# EAGLE design Rev01 (EAGLE 7.4.0)
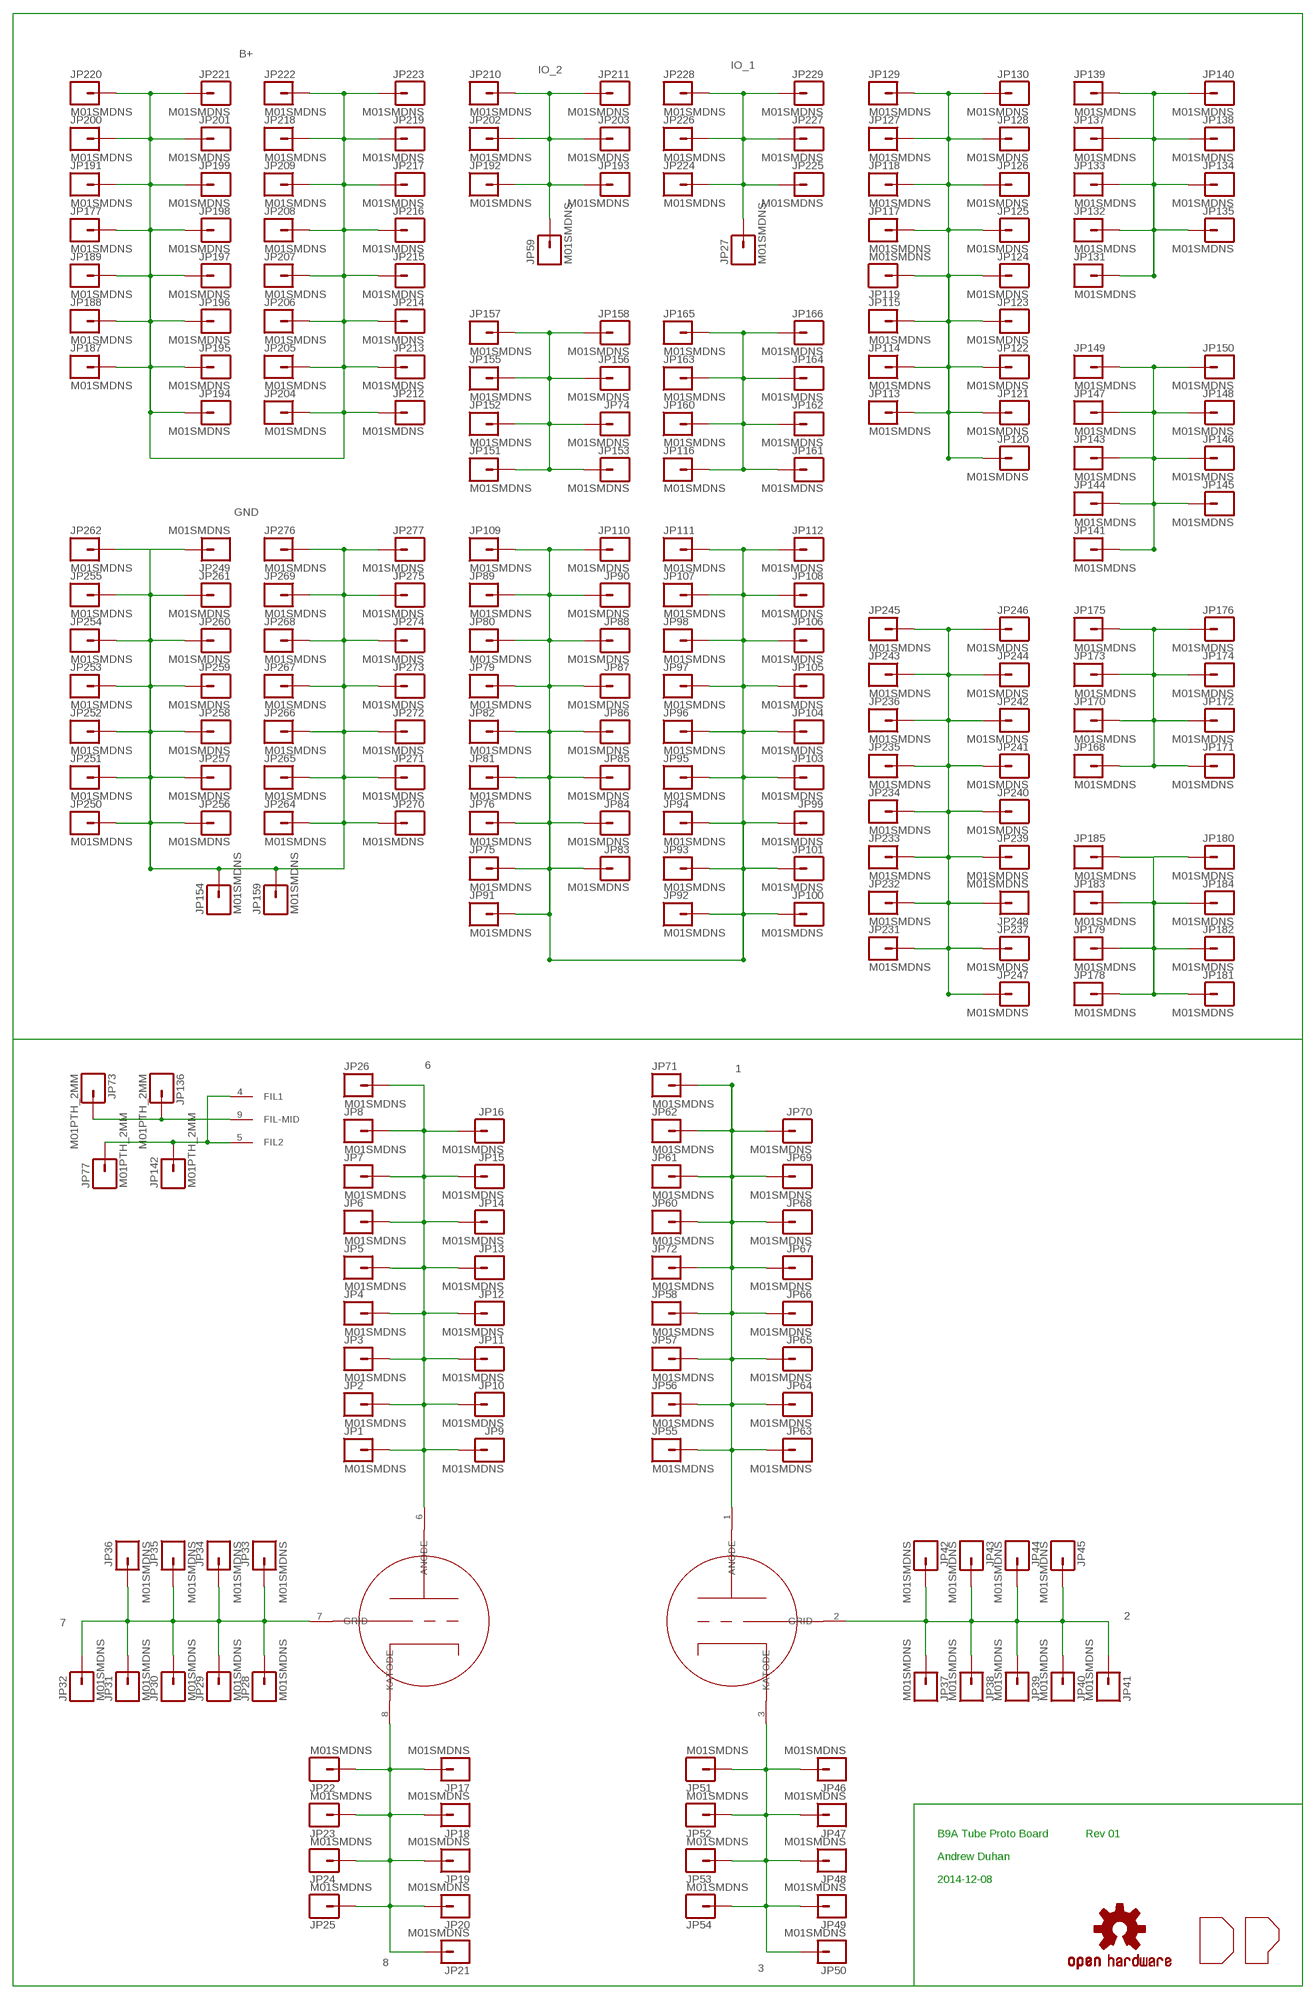
[diagram p0: schematic, sheet 1]

## Parts
JP1  M01SMDNS  [1X01NS]
JP2  M01SMDNS  [1X01NS]
JP3  M01SMDNS  [1X01NS]
JP4  M01SMDNS  [1X01NS]
JP5  M01SMDNS  [1X01NS]
JP6  M01SMDNS  [1X01NS]
JP7  M01SMDNS  [1X01NS]
JP8  M01SMDNS  [1X01NS]
JP9  M01SMDNS  [1X01NS]
JP10  M01SMDNS  [1X01NS]
JP11  M01SMDNS  [1X01NS]
JP12  M01SMDNS  [1X01NS]
JP13  M01SMDNS  [1X01NS]
JP14  M01SMDNS  [1X01NS]
JP15  M01SMDNS  [1X01NS]
JP16  M01SMDNS  [1X01NS]
JP17  M01SMDNS  [1X01NS]
JP18  M01SMDNS  [1X01NS]
JP19  M01SMDNS  [1X01NS]
JP20  M01SMDNS  [1X01NS]
JP21  M01SMDNS  [1X01NS]
JP22  M01SMDNS  [1X01NS]
JP23  M01SMDNS  [1X01NS]
JP24  M01SMDNS  [1X01NS]
JP25  M01SMDNS  [1X01NS]
JP26  M01SMDNS  [1X01NS]
JP27  M01SMDNS  [1X01NS]
JP28  M01SMDNS  [1X01NS]
JP29  M01SMDNS  [1X01NS]
JP30  M01SMDNS  [1X01NS]
JP31  M01SMDNS  [1X01NS]
JP32  M01SMDNS  [1X01NS]
JP33  M01SMDNS  [1X01NS]
JP34  M01SMDNS  [1X01NS]
JP35  M01SMDNS  [1X01NS]
JP36  M01SMDNS  [1X01NS]
JP37  M01SMDNS  [1X01NS]
JP38  M01SMDNS  [1X01NS]
JP39  M01SMDNS  [1X01NS]
JP40  M01SMDNS  [1X01NS]
JP41  M01SMDNS  [1X01NS]
JP42  M01SMDNS  [1X01NS]
JP43  M01SMDNS  [1X01NS]
JP44  M01SMDNS  [1X01NS]
JP45  M01SMDNS  [1X01NS]
JP46  M01SMDNS  [1X01NS]
JP47  M01SMDNS  [1X01NS]
JP48  M01SMDNS  [1X01NS]
JP49  M01SMDNS  [1X01NS]
JP50  M01SMDNS  [1X01NS]
JP51  M01SMDNS  [1X01NS]
JP52  M01SMDNS  [1X01NS]
JP53  M01SMDNS  [1X01NS]
JP54  M01SMDNS  [1X01NS]
JP55  M01SMDNS  [1X01NS]
JP56  M01SMDNS  [1X01NS]
JP57  M01SMDNS  [1X01NS]
JP58  M01SMDNS  [1X01NS]
JP59  M01SMDNS  [1X01NS]
JP60  M01SMDNS  [1X01NS]
JP61  M01SMDNS  [1X01NS]
JP62  M01SMDNS  [1X01NS]
JP63  M01SMDNS  [1X01NS]
JP64  M01SMDNS  [1X01NS]
JP65  M01SMDNS  [1X01NS]
JP66  M01SMDNS  [1X01NS]
JP67  M01SMDNS  [1X01NS]
JP68  M01SMDNS  [1X01NS]
JP69  M01SMDNS  [1X01NS]
JP70  M01SMDNS  [1X01NS]
JP71  M01SMDNS  [1X01NS]
JP72  M01SMDNS  [1X01NS]
JP73  M01PTH_2MM  [1X01_2MM]
JP74  M01SMDNS  [1X01NS]
JP75  M01SMDNS  [1X01NS]
JP76  M01SMDNS  [1X01NS]
JP77  M01PTH_2MM  [1X01_2MM]
JP79  M01SMDNS  [1X01NS]
JP80  M01SMDNS  [1X01NS]
JP81  M01SMDNS  [1X01NS]
JP82  M01SMDNS  [1X01NS]
JP83  M01SMDNS  [1X01NS]
JP84  M01SMDNS  [1X01NS]
JP85  M01SMDNS  [1X01NS]
JP86  M01SMDNS  [1X01NS]
JP87  M01SMDNS  [1X01NS]
JP88  M01SMDNS  [1X01NS]
JP89  M01SMDNS  [1X01NS]
JP90  M01SMDNS  [1X01NS]
JP91  M01SMDNS  [1X01NS]
JP92  M01SMDNS  [1X01NS]
JP93  M01SMDNS  [1X01NS]
JP94  M01SMDNS  [1X01NS]
JP95  M01SMDNS  [1X01NS]
JP96  M01SMDNS  [1X01NS]
JP97  M01SMDNS  [1X01NS]
JP98  M01SMDNS  [1X01NS]
JP99  M01SMDNS  [1X01NS]
JP100  M01SMDNS  [1X01NS]
JP101  M01SMDNS  [1X01NS]
JP103  M01SMDNS  [1X01NS]
JP104  M01SMDNS  [1X01NS]
JP105  M01SMDNS  [1X01NS]
JP106  M01SMDNS  [1X01NS]
JP107  M01SMDNS  [1X01NS]
JP108  M01SMDNS  [1X01NS]
JP109  M01SMDNS  [1X01NS]
JP110  M01SMDNS  [1X01NS]
JP111  M01SMDNS  [1X01NS]
JP112  M01SMDNS  [1X01NS]
JP113  M01SMDNS  [1X01NS]
JP114  M01SMDNS  [1X01NS]
JP115  M01SMDNS  [1X01NS]
JP116  M01SMDNS  [1X01NS]
JP117  M01SMDNS  [1X01NS]
JP118  M01SMDNS  [1X01NS]
JP119  M01SMDNS  [1X01NS]
JP120  M01SMDNS  [1X01NS]
JP121  M01SMDNS  [1X01NS]
JP122  M01SMDNS  [1X01NS]
JP123  M01SMDNS  [1X01NS]
JP124  M01SMDNS  [1X01NS]
JP125  M01SMDNS  [1X01NS]
JP126  M01SMDNS  [1X01NS]
JP127  M01SMDNS  [1X01NS]
JP128  M01SMDNS  [1X01NS]
JP129  M01SMDNS  [1X01NS]
JP130  M01SMDNS  [1X01NS]
JP131  M01SMDNS  [1X01NS]
JP132  M01SMDNS  [1X01NS]
JP133  M01SMDNS  [1X01NS]
JP134  M01SMDNS  [1X01NS]
JP135  M01SMDNS  [1X01NS]
JP136  M01PTH_2MM  [1X01_2MM]
JP137  M01SMDNS  [1X01NS]
JP138  M01SMDNS  [1X01NS]
JP139  M01SMDNS  [1X01NS]
JP140  M01SMDNS  [1X01NS]
JP141  M01SMDNS  [1X01NS]
JP142  M01PTH_2MM  [1X01_2MM]
JP143  M01SMDNS  [1X01NS]
JP144  M01SMDNS  [1X01NS]
JP145  M01SMDNS  [1X01NS]
JP146  M01SMDNS  [1X01NS]
JP147  M01SMDNS  [1X01NS]
JP148  M01SMDNS  [1X01NS]
JP149  M01SMDNS  [1X01NS]
JP150  M01SMDNS  [1X01NS]
JP151  M01SMDNS  [1X01NS]
JP152  M01SMDNS  [1X01NS]
JP153  M01SMDNS  [1X01NS]
JP154  M01SMDNS  [1X01NS]
JP155  M01SMDNS  [1X01NS]
JP156  M01SMDNS  [1X01NS]
JP157  M01SMDNS  [1X01NS]
JP158  M01SMDNS  [1X01NS]
JP159  M01SMDNS  [1X01NS]
JP160  M01SMDNS  [1X01NS]
JP161  M01SMDNS  [1X01NS]
JP162  M01SMDNS  [1X01NS]
JP163  M01SMDNS  [1X01NS]
JP164  M01SMDNS  [1X01NS]
JP165  M01SMDNS  [1X01NS]
JP166  M01SMDNS  [1X01NS]
JP168  M01SMDNS  [1X01NS]
JP170  M01SMDNS  [1X01NS]
JP171  M01SMDNS  [1X01NS]
JP172  M01SMDNS  [1X01NS]
JP173  M01SMDNS  [1X01NS]
JP174  M01SMDNS  [1X01NS]
JP175  M01SMDNS  [1X01NS]
JP176  M01SMDNS  [1X01NS]
JP177  M01SMDNS  [1X01NS]
JP178  M01SMDNS  [1X01NS]
JP179  M01SMDNS  [1X01NS]
JP180  M01SMDNS  [1X01NS]
JP181  M01SMDNS  [1X01NS]
JP182  M01SMDNS  [1X01NS]
JP183  M01SMDNS  [1X01NS]
JP184  M01SMDNS  [1X01NS]
JP185  M01SMDNS  [1X01NS]
JP187  M01SMDNS  [1X01NS]
JP188  M01SMDNS  [1X01NS]
JP189  M01SMDNS  [1X01NS]
JP191  M01SMDNS  [1X01NS]
JP192  M01SMDNS  [1X01NS]
JP193  M01SMDNS  [1X01NS]
JP194  M01SMDNS  [1X01NS]
JP195  M01SMDNS  [1X01NS]
JP196  M01SMDNS  [1X01NS]
JP197  M01SMDNS  [1X01NS]
JP198  M01SMDNS  [1X01NS]
JP199  M01SMDNS  [1X01NS]
JP200  M01SMDNS  [1X01NS]
JP201  M01SMDNS  [1X01NS]
JP202  M01SMDNS  [1X01NS]
JP203  M01SMDNS  [1X01NS]
JP204  M01SMDNS  [1X01NS]
JP205  M01SMDNS  [1X01NS]
JP206  M01SMDNS  [1X01NS]
JP207  M01SMDNS  [1X01NS]
JP208  M01SMDNS  [1X01NS]
JP209  M01SMDNS  [1X01NS]
JP210  M01SMDNS  [1X01NS]
JP211  M01SMDNS  [1X01NS]
JP212  M01SMDNS  [1X01NS]
JP213  M01SMDNS  [1X01NS]
JP214  M01SMDNS  [1X01NS]
JP215  M01SMDNS  [1X01NS]
JP216  M01SMDNS  [1X01NS]
JP217  M01SMDNS  [1X01NS]
JP218  M01SMDNS  [1X01NS]
JP219  M01SMDNS  [1X01NS]
JP220  M01SMDNS  [1X01NS]
JP221  M01SMDNS  [1X01NS]
JP222  M01SMDNS  [1X01NS]
JP223  M01SMDNS  [1X01NS]
JP224  M01SMDNS  [1X01NS]
JP225  M01SMDNS  [1X01NS]
JP226  M01SMDNS  [1X01NS]
JP227  M01SMDNS  [1X01NS]
JP228  M01SMDNS  [1X01NS]
JP229  M01SMDNS  [1X01NS]
JP231  M01SMDNS  [1X01NS]
JP232  M01SMDNS  [1X01NS]
JP233  M01SMDNS  [1X01NS]
JP234  M01SMDNS  [1X01NS]
JP235  M01SMDNS  [1X01NS]
JP236  M01SMDNS  [1X01NS]
JP237  M01SMDNS  [1X01NS]
JP239  M01SMDNS  [1X01NS]
JP240  M01SMDNS  [1X01NS]
JP241  M01SMDNS  [1X01NS]
JP242  M01SMDNS  [1X01NS]
JP243  M01SMDNS  [1X01NS]
JP244  M01SMDNS  [1X01NS]
JP245  M01SMDNS  [1X01NS]
JP246  M01SMDNS  [1X01NS]
JP247  M01SMDNS  [1X01NS]
JP248  M01SMDNS  [1X01NS]
JP249  M01SMDNS  [1X01NS]
JP250  M01SMDNS  [1X01NS]
JP251  M01SMDNS  [1X01NS]
JP252  M01SMDNS  [1X01NS]
JP253  M01SMDNS  [1X01NS]
JP254  M01SMDNS  [1X01NS]
JP255  M01SMDNS  [1X01NS]
JP256  M01SMDNS  [1X01NS]
JP257  M01SMDNS  [1X01NS]
JP258  M01SMDNS  [1X01NS]
JP259  M01SMDNS  [1X01NS]
JP260  M01SMDNS  [1X01NS]
JP261  M01SMDNS  [1X01NS]
JP262  M01SMDNS  [1X01NS]
JP264  M01SMDNS  [1X01NS]
JP265  M01SMDNS  [1X01NS]
JP266  M01SMDNS  [1X01NS]
JP267  M01SMDNS  [1X01NS]
JP268  M01SMDNS  [1X01NS]
JP269  M01SMDNS  [1X01NS]
JP270  M01SMDNS  [1X01NS]
JP271  M01SMDNS  [1X01NS]
JP272  M01SMDNS  [1X01NS]
JP273  M01SMDNS  [1X01NS]
JP274  M01SMDNS  [1X01NS]
JP275  M01SMDNS  [1X01NS]
JP276  M01SMDNS  [1X01NS]
JP277  M01SMDNS  [1X01NS]
LOGO1  OSHW-LOGOM  [OSHW-LOGO-M]
U$1  12AX7  [12AX7-ROUND]
U$2  DP_LOGO  [DP_LOGO]

## Nets
1: JP55.1 JP56.1 JP57.1 JP58.1 JP60.1 JP61.1 JP62.1 JP63.1 JP64.1 JP65.1 JP66.1 JP67.1 JP68.1 JP69.1 JP70.1 JP71.1 JP72.1 U$1.1(ANODE)
2: JP37.1 JP38.1 JP39.1 JP40.1 JP41.1 JP42.1 JP43.1 JP44.1 JP45.1 U$1.2(GRID)
3: JP46.1 JP47.1 JP48.1 JP49.1 JP50.1 JP51.1 JP52.1 JP53.1 JP54.1 U$1.3(KATODE)
4/5: JP77.1 JP142.1 U$1.4(FIL1) U$1.5(FIL2)
6: JP1.1 JP2.1 JP3.1 JP4.1 JP5.1 JP6.1 JP7.1 JP8.1 JP9.1 JP10.1 JP11.1 JP12.1 JP13.1 JP14.1 JP15.1 JP16.1 JP26.1 U$1.6(ANODE)
7: JP28.1 JP29.1 JP30.1 JP31.1 JP32.1 JP33.1 JP34.1 JP35.1 JP36.1 U$1.7(GRID)
8: JP17.1 JP18.1 JP19.1 JP20.1 JP21.1 JP22.1 JP23.1 JP24.1 JP25.1 U$1.8(KATODE)
9: JP73.1 JP136.1 U$1.9(FIL-MID)
B+: JP177.1 JP187.1 JP188.1 JP189.1 JP191.1 JP194.1 JP195.1 JP196.1 JP197.1 JP198.1 JP199.1 JP200.1 JP201.1 JP204.1 JP205.1 JP206.1 JP207.1 JP208.1 JP209.1 JP212.1 JP213.1 JP214.1 JP215.1 JP216.1 JP217.1 JP218.1 JP219.1 JP220.1 JP221.1 JP222.1 JP223.1
GND: JP154.1 JP159.1 JP249.1 JP250.1 JP251.1 JP252.1 JP253.1 JP254.1 JP255.1 JP256.1 JP257.1 JP258.1 JP259.1 JP260.1 JP261.1 JP262.1 JP264.1 JP265.1 JP266.1 JP267.1 JP268.1 JP269.1 JP270.1 JP271.1 JP272.1 JP273.1 JP274.1 JP275.1 JP276.1 JP277.1
IO_1: JP27.1 JP224.1 JP225.1 JP226.1 JP227.1 JP228.1 JP229.1
IO_2: JP59.1 JP192.1 JP193.1 JP202.1 JP203.1 JP210.1 JP211.1
N$7: JP75.1 JP76.1 JP79.1 JP80.1 JP81.1 JP82.1 JP83.1 JP84.1 JP85.1 JP86.1 JP87.1 JP88.1 JP89.1 JP90.1 JP91.1 JP92.1 JP93.1 JP94.1 JP95.1 JP96.1 JP97.1 JP98.1 JP99.1 JP100.1 JP101.1 JP103.1 JP104.1 JP105.1 JP106.1 JP107.1 JP108.1 JP109.1 JP110.1 JP111.1 JP112.1
N$8: JP113.1 JP114.1 JP115.1 JP117.1 JP118.1 JP119.1 JP120.1 JP121.1 JP122.1 JP123.1 JP124.1 JP125.1 JP126.1 JP127.1 JP128.1 JP129.1 JP130.1
N$9: JP131.1 JP132.1 JP133.1 JP134.1 JP135.1 JP137.1 JP138.1 JP139.1 JP140.1
N$10: JP141.1 JP143.1 JP144.1 JP145.1 JP146.1 JP147.1 JP148.1 JP149.1 JP150.1
N$11: JP74.1 JP151.1 JP152.1 JP153.1 JP155.1 JP156.1 JP157.1 JP158.1
N$12: JP116.1 JP160.1 JP161.1 JP162.1 JP163.1 JP164.1 JP165.1 JP166.1
N$13: JP168.1 JP170.1 JP171.1 JP172.1 JP173.1 JP174.1 JP175.1 JP176.1
N$14: JP178.1 JP179.1 JP180.1 JP181.1 JP182.1 JP183.1 JP184.1 JP185.1
N$18: JP231.1 JP232.1 JP233.1 JP234.1 JP235.1 JP236.1 JP237.1 JP239.1 JP240.1 JP241.1 JP242.1 JP243.1 JP244.1 JP245.1 JP246.1 JP247.1 JP248.1

## Notes on the sheet
- B9A Tube Proto Board | Rev 01
- Andrew Duhan
- 2014-12-08

## Library data of the parts
JP1-JP77 JP79-JP101 JP103-JP166 JP168 JP170-JP185 JP187-JP189 JP191-JP229 JP231-JP237 JP239-JP262 JP264-JP277 = SparkFun-Connectors:M01: Header 1 Standard 1-pin 0.1" header. Use with straight break away headers (SKU : PRT-00116), right angle break away headers (PRT-00553), swiss pins (PRT-00743), machine pins (PRT-00117), and female headers (PRT-00115).
LOGO1 = SparkFun-Aesthetics:OSHW-LOGO: Open Source Hardware Logo This logo indicates the piece of hardware it is found on incorporates a OSHW license and/or adheres to the definition of open source hardware found here: http://freedomdefined.org/OSHW
U$1 = 12ax7:12AX7
U$2 = myparts:DP_LOGO: Duhan Power! logo

## Board
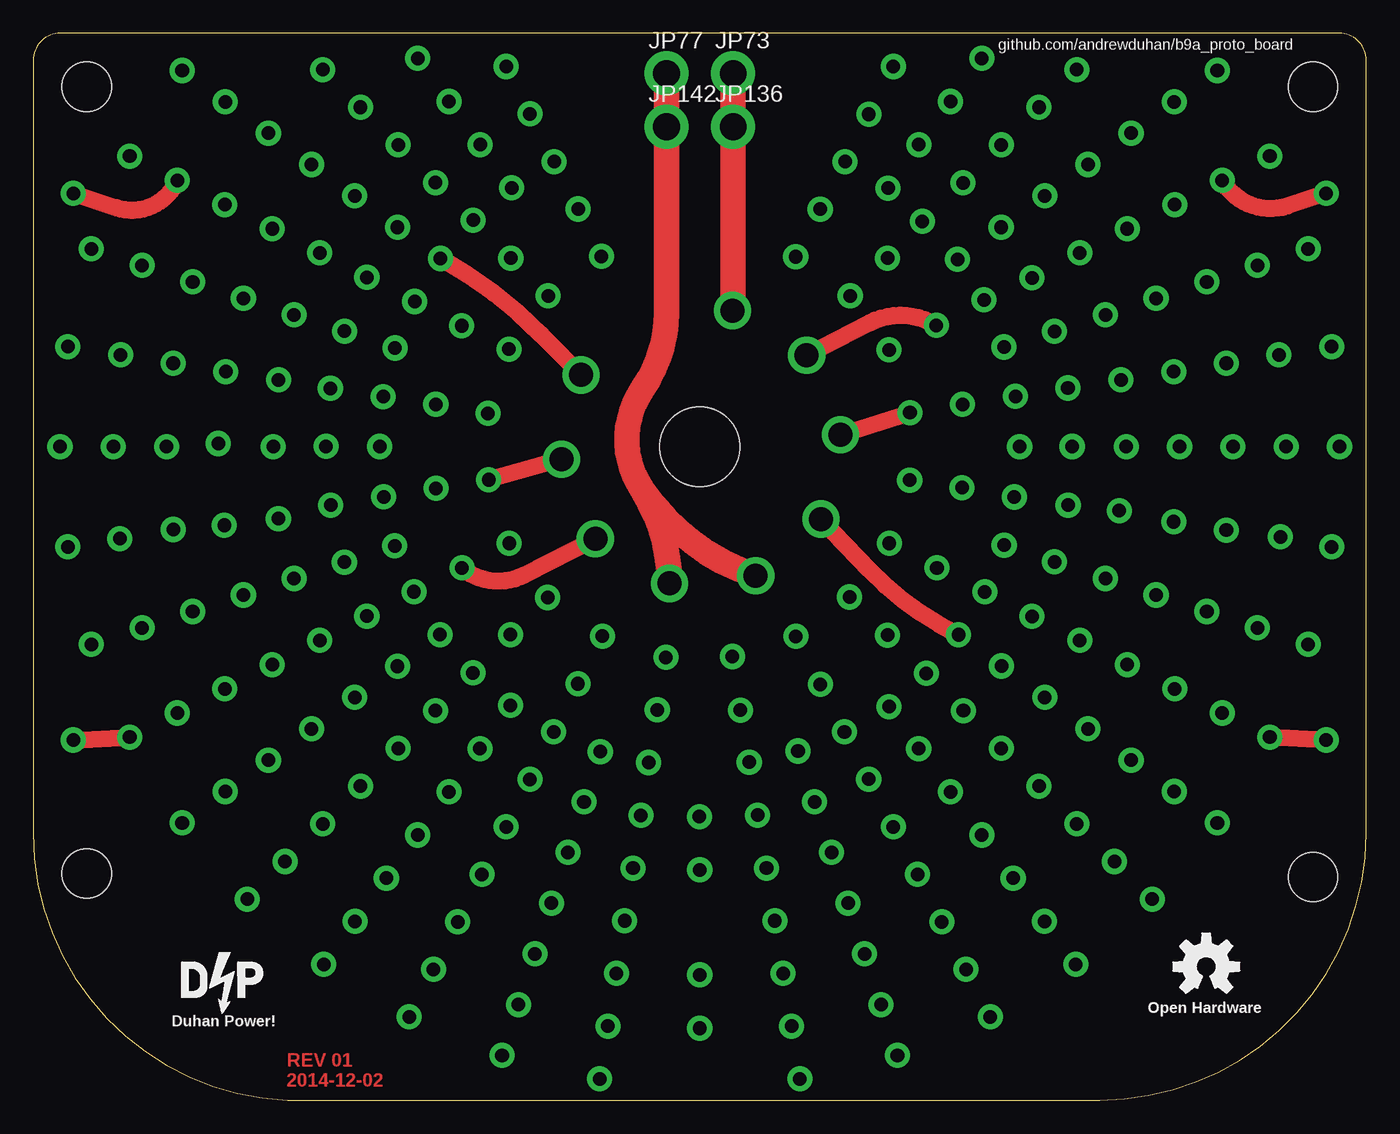
[diagram p1: board, top side]
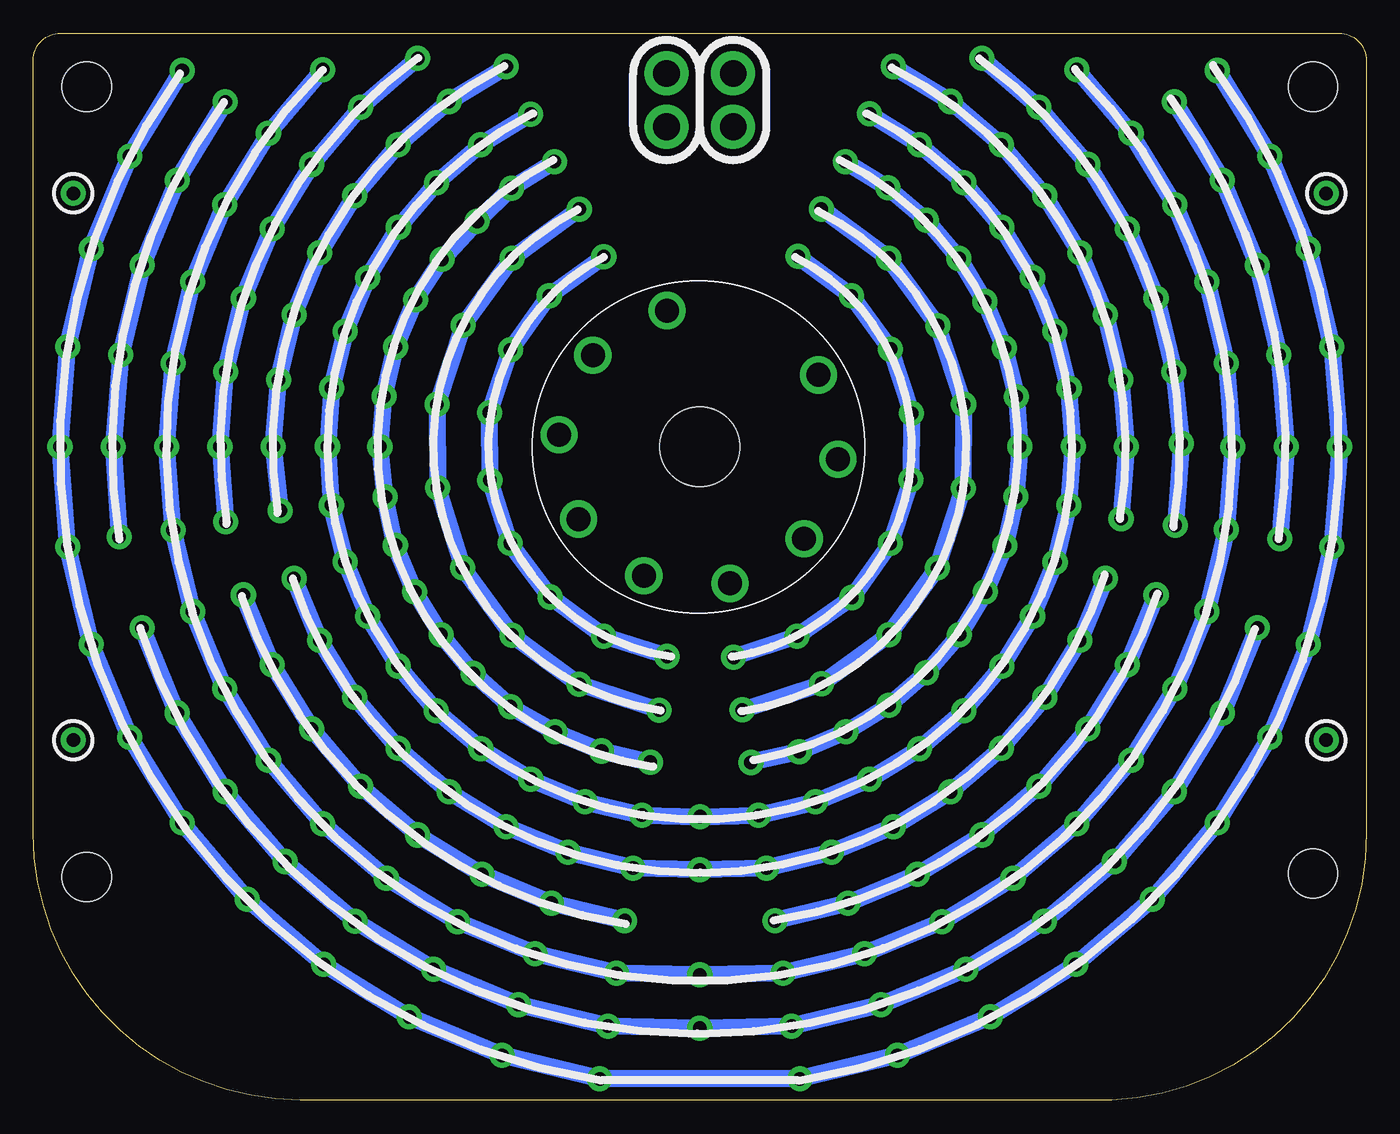
[diagram p2: board, bottom side, seen from below]

Size 100 x 80.01 mm. Coordinates in mm from the lower left corner, seen from the top.
Outline: 0,20.01 arc93 21,0.01 80,0.01 arc90 100,20.01 100,78.01 arc90 98,80.01 2,80.01 arc90 0,78.01 0,20.01
Copper layers (1*16): Top 0.035mm / dielectric 1.5mm / Bottom 0.035mm
Design rules "dirt_cheap_dirty_boards.v1": minimum track width 5mil, minimum drill 12mil, track to track 5mil, track to pad 5mil, pad to pad 5mil, via to via 5mil, smd to smd 0mil, copper to edge 10mil, drill to drill 10mil, minimum pad ring 10mil, minimum via ring 6mil, stop-mask expansion 2mil, vias tented up to drill 25mil, thermal gap 10mil
Holes 3.7 mm at 4,76.01 96,76.01 96,16.74 4,17.01
Holes 6 mm at 50,49.01

### Footprints (pad centres in the part's own frame; a part is rotated, then mirrored left to right if it is on the bottom)
1X01NS = drill 1.016 pad 1.88: 1 0,0
1X01_2MM = drill 2 pad 3.302: 1 0,0
12AX7-ROUND = drill 1.8 pad 2.794: 1 6.172,8.495; 2 9.986,3.245; 3 9.986,-3.245; 4 6.172,-8.495; 5 0,-10.5; 6 -6.172,-8.495; 7 -9.986,-3.245; 8 -9.986,3.245; 9 -6.172,8.495

### Placement (x,y rotation side)
JP1  60.86,27.62 0 top
JP2  57.37,26.19 0 top
JP3  53.71,25.35 0 top
JP4  64.2,29.51 0 top
JP5  67,32.01 0 top
JP6  71.32,60.02 0 top
JP7  69.35,63.07 0 top
JP8  66.7,65.91 0 top
JP9  64.12,68.41 0 top
JP10  72.83,56.49 0 top
JP11  73.69,52.78 0 top
JP12  74,49.01 0 top
JP13  72.84,41.63 0 top
JP14  73.59,45.24 0 top
JP15  71.38,38.12 0 top
JP16  69.42,34.91 0 top
JP17  64.09,63.16 0 top
JP18  67.74,58.11 0 top
JP19  69.71,52.19 0 top
JP20  67.79,39.92 0 top
JP21  69.68,45.94 0 top
JP22  59.04,66.83 0 top
JP23  64.09,34.88 0 top
JP24  59.05,31.19 0 top
JP25  53.04,29.25 0 top
JP26  60.9,70.4 0 top
JP27  3,68.01 0 top
JP28  65.75,46.5 0 top
JP29  52.44,33.28 0 top
JP30  65.77,51.56 0 top
JP31  64.22,41.77 0 top
JP32  57.2,63.26 0 top
JP33  64.2,56.27 0 top
JP34  61.24,37.74 0 top
JP35  57.22,34.79 0 top
JP36  61.29,60.32 0 top
JP37  35.7,41.77 0 top
JP38  34.17,46.53 0 top
JP39  34.11,51.51 0 top
JP40  38.63,60.33 0 top
JP41  35.68,56.33 0 top
JP42  38.59,37.7 0 top
JP43  47.46,33.21 0 top
JP44  42.63,63.28 0 top
JP45  42.7,34.8 0 top
JP46  32.16,39.92 0 top
JP47  35.8,34.92 0 top
JP48  40.86,31.23 0 top
JP49  30.22,45.89 0 top
JP50  30.2,52.18 0 top
JP51  32.15,58.08 0 top
JP52  46.81,29.27 0 top
JP53  40.88,66.84 0 top
JP54  35.83,63.15 0 top
JP55  39.08,70.4 0 top
JP56  35.89,68.43 0 top
JP57  26.26,52.77 0 top
JP58  25.99,49.02 0 top
JP59  97,68.01 0 top
JP60  30.55,63.13 0 top
JP61  27.14,56.41 0 top
JP62  26.29,45.25 0 top
JP63  33.01,66 0 top
JP64  28.61,59.9 0 top
JP65  46.16,25.33 0 top
JP66  27.11,41.57 0 top
JP67  42.54,26.14 90 top
JP68  35.8,29.61 0 top
JP69  30.51,34.92 0 top
JP70  28.56,38.13 0 top
JP71  39.05,27.63 0 top
JP72  32.99,32.04 0 top
JP73  52.5,77.01 0 top
JP74  14.33,43.12 0 top
JP75  23.34,40.36 0 top
JP76  25.03,36.3 0 top
JP77  47.5,77.01 0 top
JP79  22.31,44.62 0 top
JP80  27.32,32.54 0 top
JP81  37.26,73.97 0 top
JP82  33.52,71.67 0 top
JP83  21.97,49.04 0 top
JP84  30.17,29.22 0 top
JP85  30.17,68.81 0 top
JP86  27.33,65.47 0 top
JP87  22.29,53.39 0 top
JP88  33.52,26.36 0 top
JP89  25.03,61.72 0 top
JP90  23.35,57.68 0 top
JP91  77.94,49.02 0 top
JP92  76.61,57.66 0 top
JP93  72.61,65.47 0 top
JP94  66.43,71.66 0 top
JP95  77.62,53.41 0 top
JP96  74.93,61.67 0 top
JP97  69.76,68.79 0 top
JP98  62.69,73.94 0 top
JP99  77.64,44.63 0 top
JP100  49.97,21.27 0 top
JP101  45.59,21.36 0 top
JP103  76.61,40.38 0 top
JP104  54.35,21.38 0 top
JP105  41.32,22.38 0 top
JP106  37.27,24.06 0 top
JP107  74.93,36.29 0 top
JP108  58.62,22.37 0 top
JP109  72.64,32.56 0 top
JP110  62.68,24.07 0 top
JP111  69.78,29.22 0 top
JP112  66.42,26.36 0 top
JP113  80.43,39.12 0 top
JP114  78.51,34.49 0 top
JP115  75.89,30.2 0 top
JP116  85.56,43.38 0 top
JP117  19.57,39.12 0 top
JP118  24.11,30.2 0 top
JP119  21.49,34.49 0 top
JP120  27.37,26.39 0 top
JP121  31.19,23.12 0 top
JP122  35.47,20.5 0 top
JP123  40.11,18.58 0 top
JP124  59.89,18.58 0 top
JP125  55.01,17.41 0 top
JP126  50,17.27 0 top
JP127  44.99,17.41 0 top
JP128  64.53,20.5 0 top
JP129  68.81,23.12 0 top
JP130  72.63,26.39 0 top
JP131  19.57,58.9 0 top
JP132  18.39,54.02 0 top
JP133  18.39,43.61 0 top
JP134  21.49,63.54 0 top
JP135  18,49.01 0 top
JP136  52.5,73.01 0 top
JP137  24.11,67.82 0 top
JP138  31.19,74.9 0 top
JP139  35.47,77.53 0 top
JP140  27.37,71.64 0 top
JP141  78.51,63.54 0 top
JP142  47.5,73.01 0 top
JP143  81.48,44.22 0 top
JP144  80.43,58.9 0 top
JP145  72.63,71.64 0 top
JP146  64.53,77.53 0 top
JP147  81.61,54.02 0 top
JP148  75.89,67.82 0 top
JP149  68.81,74.9 0 top
JP150  82,49.01 0 top
JP151  14.44,54.64 0 top
JP152  13.88,49.25 0 top
JP153  15.76,60.14 0 top
JP154  3,27.01 0 top
JP155  17.92,65.36 0 top
JP156  28.84,78.14 0 top
JP157  20.88,70.17 0 top
JP158  24.54,74.47 0 top
JP159  97,27.01 0 top
JP160  71.16,78.14 0 top
JP161  75.46,74.47 0 top
JP162  79.12,70.17 0 top
JP163  82.08,65.36 0 top
JP164  84.24,60.14 0 top
JP165  86,49.01 0 top
JP166  85.56,54.64 0 top
JP168  15.76,37.89 0 top
JP170  17.92,32.67 0 top
JP171  20.88,27.85 0 top
JP172  24.54,23.56 0 top
JP173  38.88,14.77 0 top
JP174  33.66,16.94 0 top
JP175  28.84,19.89 0 top
JP176  44.37,13.46 0 top
JP177  88.04,36.65 0 top
JP178  71.16,19.89 0 top
JP179  75.46,23.56 0 top
JP180  55.63,13.46 0 top
JP181  61.12,14.77 0 top
JP182  79.12,27.85 0 top
JP183  84.24,37.89 0 top
JP184  66.34,16.94 0 top
JP185  82.08,32.67 0 top
JP187  89.51,42.76 0 top
JP188  14.36,67.17 0 top
JP189  10.49,55.27 0 top
JP191  78.28,77.3 0 top
JP192  93.57,42.24 0 top
JP193  85.6,74.88 0 top
JP194  11.96,61.37 0 top
JP195  10,49.01 0 top
JP196  21.72,77.3 0 top
JP197  82.36,72.52 0 top
JP198  85.64,67.17 0 top
JP199  88.04,61.37 0 top
JP200  10.5,42.8 0 top
JP201  17.64,72.52 0 top
JP202  89.2,68.99 0 top
JP203  94,49.01 0 top
JP204  90,49.01 0 top
JP205  89.51,55.27 0 top
JP206  50,9.39 0 top
JP207  56.26,9.51 0 top
JP208  85.64,30.85 0 top
JP209  26.49,16.65 0 top
JP210  91.85,62.61 0 top
JP211  93.46,55.9 0 top
JP212  43.74,9.51 0 top
JP213  62.36,10.97 0 top
JP214  78.28,20.73 0 top
JP215  11.96,36.65 0 top
JP216  21.72,20.73 0 top
JP217  31.84,13.37 0 top
JP218  68.16,13.37 0 top
JP219  73.51,16.65 0 top
JP220  82.36,25.5 0 top
JP221  14.36,30.85 0 top
JP222  17.64,25.5 0 top
JP223  37.64,10.97 0 top
JP224  10.8,68.99 0 top
JP225  6.49,42.12 0 top
JP226  6,49.01 0 top
JP227  14.4,74.88 0 top
JP228  6.54,55.9 0 top
JP229  8.15,62.61 0 top
JP231  63.6,7.17 0 top
JP232  69.98,9.81 0 top
JP233  75.86,13.42 0 top
JP234  91.85,35.42 0 top
JP235  89.2,29.04 0 top
JP236  81.11,17.9 0 top
JP237  85.6,23.15 0 top
JP239  8.15,35.42 0 top
JP240  10.8,29.04 0 top
JP241  14.4,23.15 0 top
JP242  36.4,7.17 0 top
JP243  30.02,9.81 0 top
JP244  24.14,13.42 0 top
JP245  18.89,17.9 0 top
JP246  43.12,5.55 0 top
JP247  50,5.39 0 top
JP248  56.88,5.55 0 top
JP249  71.79,6.24 0 top
JP250  64.83,3.36 0 top
JP251  98,49.01 0 top
JP252  88.83,77.23 0 top
JP253  92.77,70.8 0 top
JP254  78.21,10.18 0 top
JP255  83.94,15.07 0 top
JP256  97.41,41.5 0 top
JP257  95.65,63.85 0 top
JP258  97.41,56.52 0 top
JP259  88.83,20.8 0 top
JP260  92.77,27.22 0 top
JP261  95.65,34.18 0 top
JP262  42.49,1.6 0 top
JP264  2,49.01 0 top
JP265  4.35,34.18 0 top
JP266  35.17,3.36 0 top
JP267  57.51,1.6 0 top
JP268  11.17,77.23 0 top
JP269  2.59,41.5 0 top
JP270  7.23,27.22 0 top
JP271  28.21,6.24 0 top
JP272  4.35,63.85 0 top
JP273  7.23,70.8 0 top
JP274  11.17,20.8 0 top
JP275  16.06,15.07 0 top
JP276  21.79,10.18 0 top
JP277  2.59,56.52 0 top
LOGO1  88,10.01 0 top
U$1  50.09,48.99 337 bottom
U$2  14,9.01 0 top

### Tracks (layer width: path | path; a pad name or v marks a point on that pad's centre or on a via)
1
  Top 1.27: U$1.1 38.1,57.42 arc16 JP60.1
  Bottom 1.27: JP55.1 JP56.1 JP63.1 JP60.1 JP64.1 JP61.1 JP57.1 JP58.1 JP62.1 JP66.1 JP70.1 JP69.1 JP72.1 JP68.1 JP71.1 JP67.1 JP65.1
2
  Top 1.27: U$1.2 JP38.1
  Bottom 1.27: JP44.1 JP40.1 JP41.1 JP39.1 JP38.1 JP37.1 JP42.1 JP45.1 JP43.1
3
  Top 1.27: U$1.3 36.83,39.38 arc-67 JP46.1
  Bottom 1.27: JP53.1 JP54.1 JP51.1 JP50.1 JP49.1 JP46.1 JP47.1 JP48.1 JP52.1
4/5
  Top 1.93: JP77.1 JP142.1 47.5,59.07 arc-35 45.72,53.35 arc69 45.72,45.73 | 45.72,45.73 arc37 U$1.5 | U$1.4 arc32 45.72,45.73
6
  Top 1.27: U$1.6 62.74,39.76 arc21 JP16.1
  Bottom 1.27: JP26.1 JP9.1 JP8.1 JP7.1 JP6.1 JP10.1 JP11.1 JP12.1 JP14.1 JP13.1 JP15.1 JP16.1 JP5.1 JP4.1 JP1.1 JP2.1 JP3.1
7
  Top 1.27: U$1.7 JP30.1
  Bottom 1.27: JP32.1 JP36.1 JP33.1 JP30.1 JP28.1 JP31.1 JP34.1 JP35.1 JP29.1
8
  Top 1.27: U$1.8 62.74,58.31 arc-59 JP18.1
  Bottom 1.27: JP22.1 JP17.1 JP18.1 JP19.1 JP21.1 JP20.1 JP23.1 JP24.1 JP25.1
9
  Top 1.93: JP73.1 JP136.1 52.5,59.26 U$1.9
B+
  Bottom 1.27: JP196.1 JP201.1 JP188.1 JP194.1 JP189.1 JP195.1 JP200.1 JP215.1 JP221.1 JP222.1 JP216.1 JP209.1 JP217.1 JP223.1 JP212.1 JP206.1 JP207.1 JP213.1 JP218.1 JP219.1 JP214.1 JP220.1 JP208.1 JP177.1 JP187.1 JP204.1 JP205.1 JP199.1 JP198.1 JP197.1 JP191.1
GND
  Top 1.27: JP159.1 JP260.1 | JP154.1 JP270.1
  Bottom 1.27: JP268.1 JP273.1 JP272.1 JP277.1 JP264.1 JP269.1 JP265.1 JP270.1 JP274.1 JP275.1 JP276.1 JP271.1 JP266.1 JP262.1 JP267.1 JP250.1 JP249.1 JP254.1 JP255.1 JP259.1 JP260.1 JP261.1 JP256.1 JP251.1 JP258.1 JP257.1 JP253.1 JP252.1
IO_1
  Top 1.27: JP27.1 6.22,66.94 arc85 JP224.1
  Bottom 1.27: JP227.1 JP224.1 JP229.1 JP228.1 JP226.1 JP225.1
IO_2
  Top 1.27: JP59.1 94.11,67.07 arc-79 JP202.1
  Bottom 1.27: JP193.1 JP202.1 JP210.1 JP211.1 JP203.1 JP192.1
N$7
  Bottom 1.27: JP98.1 JP94.1 JP97.1 JP93.1 JP96.1 JP92.1 JP95.1 JP91.1 JP99.1 JP103.1 JP107.1 JP109.1 JP111.1 JP112.1 JP110.1 JP108.1 JP104.1 JP100.1 JP101.1 JP105.1 JP106.1 JP88.1 JP84.1 JP80.1 JP76.1 JP75.1 JP79.1 JP83.1 JP87.1 JP90.1 JP89.1 JP86.1 JP85.1 JP82.1 JP81.1
N$8
  Bottom 1.27: JP117.1 JP119.1 JP118.1 JP120.1 JP121.1 JP122.1 JP123.1 JP127.1 JP126.1 JP125.1 JP124.1 JP128.1 JP129.1 JP130.1 JP115.1 JP114.1 JP113.1
N$9
  Bottom 1.27: JP139.1 JP138.1 JP140.1 JP137.1 JP134.1 JP131.1 JP132.1 JP135.1 JP133.1
N$10
  Bottom 1.27: JP146.1 JP149.1 JP145.1 JP148.1 JP141.1 JP144.1 JP147.1 JP150.1 JP143.1
N$11
  Bottom 1.27: JP156.1 JP158.1 JP157.1 JP155.1 JP153.1 JP151.1 JP152.1 JP74.1
N$12
  Bottom 1.27: JP160.1 JP161.1 JP162.1 JP163.1 JP164.1 JP166.1 JP165.1 JP116.1
N$13
  Bottom 1.27: JP168.1 JP170.1 JP171.1 JP172.1 JP175.1 JP174.1 JP173.1 JP176.1
N$14
  Bottom 1.27: JP180.1 JP181.1 JP184.1 JP178.1 JP179.1 JP182.1 JP185.1 JP183.1
N$18
  Bottom 1.27: JP239.1 JP240.1 JP241.1 JP245.1 JP244.1 JP243.1 JP242.1 JP246.1 JP247.1 JP248.1 JP231.1 JP232.1 JP233.1 JP236.1 JP237.1 JP235.1 JP234.1

### Text on the board
Top: REV 01 | 2014-12-02
tPlace: github.com/andrewduhan/b9a_proto_board
tDocu: 4/5 | 9 | I/O | 1 | 6 | I/O | 3 | 8 | 2 | 7 | GND | GND | B+
bDocu: 4/5 | 9 | I/O | 1 | 6 | I/O | 3 | 8 | 2 | 7 | 9 | 8 | 1 | 7 | 2 | 6 | 3 | 4 | 5 | GND | GND | B+
_tsilk: Duhan Power! | Open Hardware